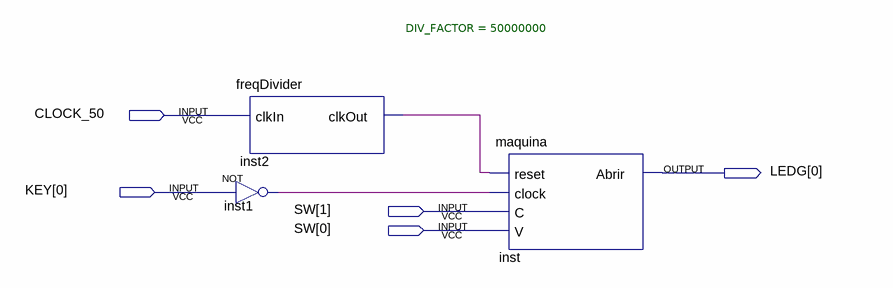
[diagram p0: schematic sheet]
// Quartus schematic Block1.bdf as structural Verilog: 3 symbols, 5 pins
module Block1 (
  input  CLOCK_50,
  input  [0:0] KEY,
  input  [1:0] SW,
  output [0:0] LEDG
);

  wire inst1_out, inst2_clkout;

  not inst1 (inst1_out, KEY[0]);
  freqDivider #(.DIV_FACTOR(50000000)) inst2 (.clkIn(CLOCK_50), .clkOut(inst2_clkout));
  maquina inst (.reset(inst2_clkout), .clock(inst1_out), .C(SW[1]), .V(SW[0]), .Abrir(LEDG[0]));
endmodule
